# EAGLE design Blinky_Orlando (EAGLE 8.2.2)
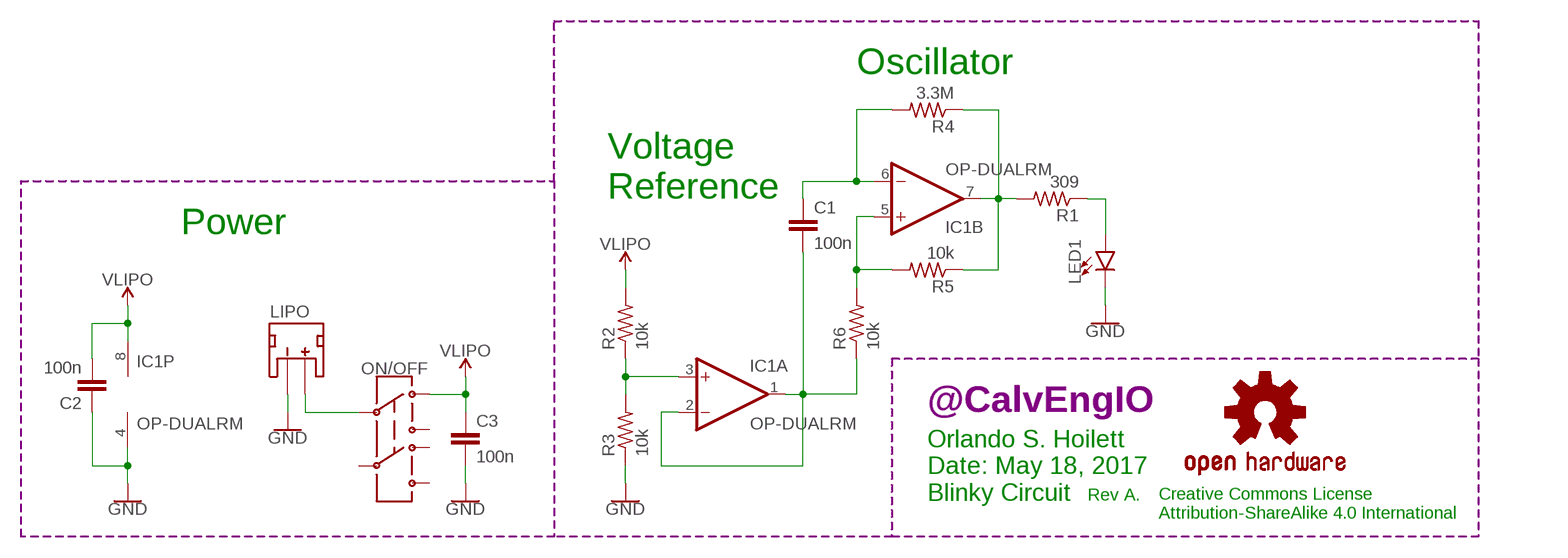
[diagram p0: schematic, sheet 1]

## Parts
C1  100n  CAPACITOR0402  [C0402]
C2  100n  CAPACITOR0402  [C0402]
C3  100n  CAPACITOR0402  [C0402]
IC1  OP-DUALRM  [MSOP08]
LED1  LED0603  [LED-0603]
LIPO  JST_2MM_MALE  [JST-2-SMD]
LOGO1  OSHW-LOGOS  [OSHW-LOGO-S]
ON/OFF  SWITCH.JS202011JCQN  [SWITCH.00]
R1  309  RESISTOR0402  [R0402]
R2  10k  RESISTOR0402  [R0402]
R3  10k  RESISTOR0402  [R0402]
R4  3.3M  RESISTOR0402  [R0402]
R5  10k  RESISTOR0402  [R0402]
R6  10k  RESISTOR0402  [R0402]
U$4  CALVENGIO_HANDLEHANDLE.05  [CALVENGIO_HANDLE.05]

## Nets
GND: C2.1 C3.2 IC1.4(P:V-) LED1.C LIPO.1(-) R3.1
N$1: C1.1 IC1.6(B:-IN) R4.2
N$2: IC1.7(B:OUT) R1.2 R4.1 R5.1
N$3: LIPO.2(+) ON/OFF.2
N$4: IC1.5(B:+IN) R5.2 R6.2
N$5: C1.2 IC1.1(A:OUT) IC1.2(A:-IN) R6.1
N$6: IC1.3(A:+IN) R2.1 R3.2
N$7: LED1.A R1.1
VLIPO: C2.2 C3.1 IC1.8(P:V+) ON/OFF.1 R2.2
Unconnected: LIPO.NC1(PAD1) LIPO.NC2(PAD2) ON/OFF.3 ON/OFF.5 ON/OFF.6 ON/OFF.7

## Notes on the sheet
- Oscillator
- Voltage
  Reference
- Power
- Orlando S. Hoilett
  Date: May 18, 2017
  Blinky Circuit
- Rev A.
- Creative Commons License
  Attribution-ShareAlike 4.0 International

## Library data of the parts
C1-C3 = CalvEngIO-Passives:CAPACITOR
IC1 = CalvEngIO-AnalogIC:OP-DUAL: Precision Micropower, Low Noise CMOS, Rail-to-Rail Input/Output Operational Amplifiers Source: http://www.analog.com/static/imported-files/data_sheets/AD8603_8607_8609.pdf; MF: ALTERA CORPORATION; MPN: AD8607ARMZ-REEL; OC_FARNELL: 1464990; OC_NEWARK: 59K6925
LED1 = CalvEngIO-LED:LED: LED (Generic) Standard schematic elements and footprints for 5mm, 3mm, 1206, and 0603 sized LEDs. Generic LEDs with no color specified. LTST-C190KGKT: arrow indicates cathode
LIPO = CalvEngIO-Connectors:JST_2MM_MALE: JST 2MM MALE RA CONNECTOR Two pin, compact surface mount connector. Commonly used as a battery input connection point. We really like the solid locking feeling and high current rating on these small connectors. We use these all the time as battery connectors. Mates to single-cell LiPo batteries. Here is the connector we sell at SparkFun: JST Right Angle Connector - White <https://www.sparkfun.com/products/8612> (PRT-08612) Datasheet <http://www.sparkfun.com/datasheets/Prototyping/Connectors/JST-Horizontal.pdf> It was used on these SparkFun products: SparkFun MOSFET Power Controller <https://www.sparkfun.com/products/11214> (PRT-11214) SparkFun Battery Babysitter - LiPo Battery Manager <https://www.sparkfun.com/products/13777> (PRT-13777) And many, many others that required a lipo battery connection.; PROD_ID: CONN-11443; SF_ID: PRT-08612
LOGO1 = CalvEngIO-Logos:OSHW-LOGO: Open-Source Hardware (OSHW) Logo This logo indicates the piece of hardware it is found on incorporates a OSHW license and/or adheres to the definition of open source hardware found here: http://freedomdefined.org/OSHW
ON/OFF = CalvEngIO-Switches:SWITCH.JS202011JCQN
R1-R6 = CalvEngIO-Passives:RESISTOR
U$4 = CalvEngIO-Logos:CALVENGIO_HANDLE

## Board
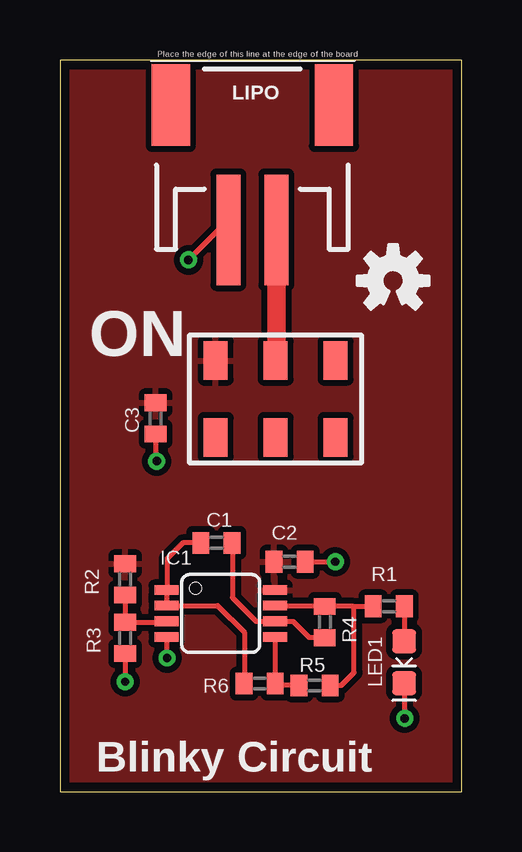
[diagram p1: board, top side]
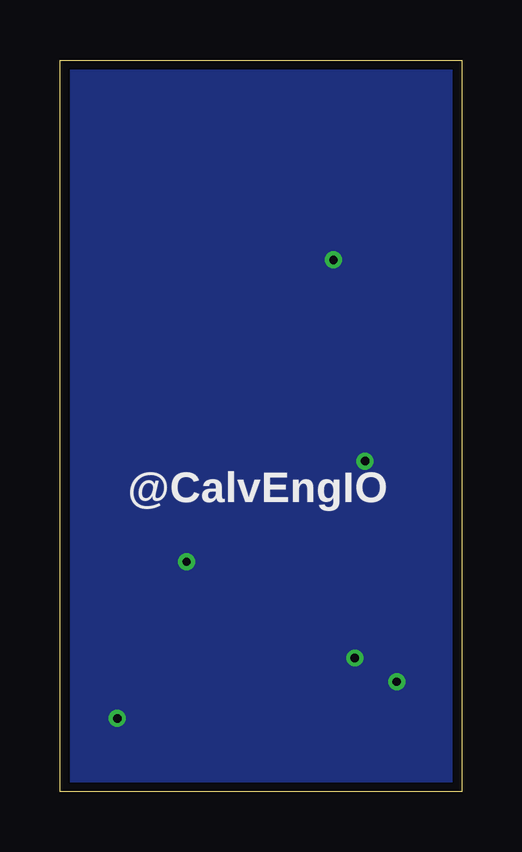
[diagram p2: board, bottom side, seen from below]

Size 16.76 x 30.48 mm. Coordinates in mm from the lower left corner, seen from the top.
Outline: 0,0 16.76,0 16.76,30.48 0,30.48 0,0
Copper layers (1*16): Top 0.0356mm / dielectric 1.5011mm / Bottom 0.0356mm
Design rules "LaenPCBOrder": minimum track width 6mil, minimum drill 13mil, track to track 6mil, track to pad 6mil, pad to pad 6mil, via to via 6mil, smd to smd 6mil, copper to edge 15mil, drill to drill 6mil, minimum pad ring 7mil, minimum via ring 7mil, stop-mask expansion 3mil, vias tented up to drill 0mil, thermal gap 10mil

### Footprints (pad centres in the part's own frame; a part is rotated, then mirrored left to right if it is on the bottom)
C0402 = smd 0.7 x 0.9: 1 -0.65,0; 2 0.65,0
MSOP08 = smd 0.4 x 1: 1 -0.976,-2.263; 2 -0.326,-2.263; 3 0.324,-2.263; 4 0.974,-2.263; 5 0.974,2.262; 6 0.324,2.262; 7 -0.326,2.262; 8 -0.976,2.262
LED-0603 = smd 1 x 1: A -0.877,0; C 0.877,0
JST-2-SMD = smd 1 x 4.6: 1 -1,-3.7; 2 1,-3.7 | smd 1.6 x 3.4: NC1 -3.4,1.5; NC2 3.4,1.5
SWITCH.00 = smd 1 x 1.6: 1 -2.5,1.6; 2 0,1.6; 3 2.5,1.6; 5 -2.5,-1.6; 6 0,-1.6; 7 2.5,-1.6
R0402 = smd 0.7 x 0.9: 1 -0.65,0; 2 0.65,0

### Placement (x,y rotation side)
C1  6.53,10.36 180 top
C2  9.58,9.58 180 top
C3  3.99,15.54 270 top
IC1  6.71,7.42 270 top
LED1  14.35,5.38 270 top
LIPO  8.03,27.1 0 top
LOGO1  13.89,21.29 0 top
ON/OFF  8.99,16.36 0 top
R1  13.72,7.72 180 top
R2  2.72,8.84 90 top
R3  2.72,6.4 90 top
R4  11.05,7.06 270 top
R5  10.62,4.42 180 top
R6  8.33,4.5 0 top
U$4  8.86,12.04 0 bottom

### Tracks (layer width: path | path; a pad name or v marks a point on that pad's centre or on a via)
GND  (via drill 0.35, 0.35 pad 0.55)
  Top 0.203: R3.1 v2.72,4.57 | LED1.C v14.38,3.05 | C2.1 v11.48,9.58 | IC1.4 4.44,5.59 v4.47,5.56 | LIPO.1 6.61,23.4 v5.36,22.15 | C3.2 3.99,13.82 v4.04,13.77
  pour Bottom (isolate 0.254): 0,30.99 16.26,30.99 16.26,0 0,0
N$1
  Top 0.203: C1.1 7.19,8.08 8.18,7.09 IC1.6 9.72,7.09 10.39,6.43 11.03,6.43 R4.2
N$2
  Top 0.203: R5.1 11.73,4.42 12.27,4.95 12.27,7.69 12.24,7.71 | IC1.7 11.02,7.74 R4.1 12.24,7.71 | 12.24,7.71 13.06,7.71 R1.2
N$3
  Top 0.406: 9.03,17.99 ON/OFF.2
  Top 0.762: LIPO.2 9.03,17.99
N$4
  Top 0.203: R5.2 9.06,4.42 R6.2 8.97,4.51 IC1.5
N$5
  Top 0.203: C1.2 5.13,10.36 4.47,9.7 4.47,8.42 IC1.1 IC1.2 6.58,7.74 7.7,6.63 7.7,4.51 R6.1
N$6
  Top 0.203: IC1.3 4.4,7.05 R3.2 R2.1
N$7
  Top 0.203: R1.1 14.37,6.28 LED1.A
VLIPO
  pour Top (isolate 0.254): 0.38,30.99 16.66,30.99 16.66,0.38 0.38,0.38

### Text on the board
tNames: ON | Blinky Circuit